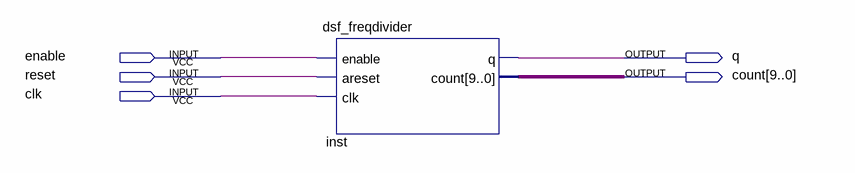
[diagram p0: schematic sheet]
// Quartus schematic dsff_freqdivider23.bdf as structural Verilog: 1 symbols, 5 pins
module dsff_freqdivider23 (
  input  enable,
  input  reset,
  input  clk,
  output q,
  output [9:0] count
);

  dsf_freqdivider inst (.enable(enable), .areset(reset), .clk(clk), .q(q), .count(count));
endmodule
